# EAGLE schematic Felderblock6-a-1 (EAGLE 9.6.2)
AUTHOR: Balazs Racz; DRAWING_TITLE: Felderblock Mockup; LICENSE: Licensed by the Solderpad Hardware License V2.0; REVISION: A1; YEAR: 2024
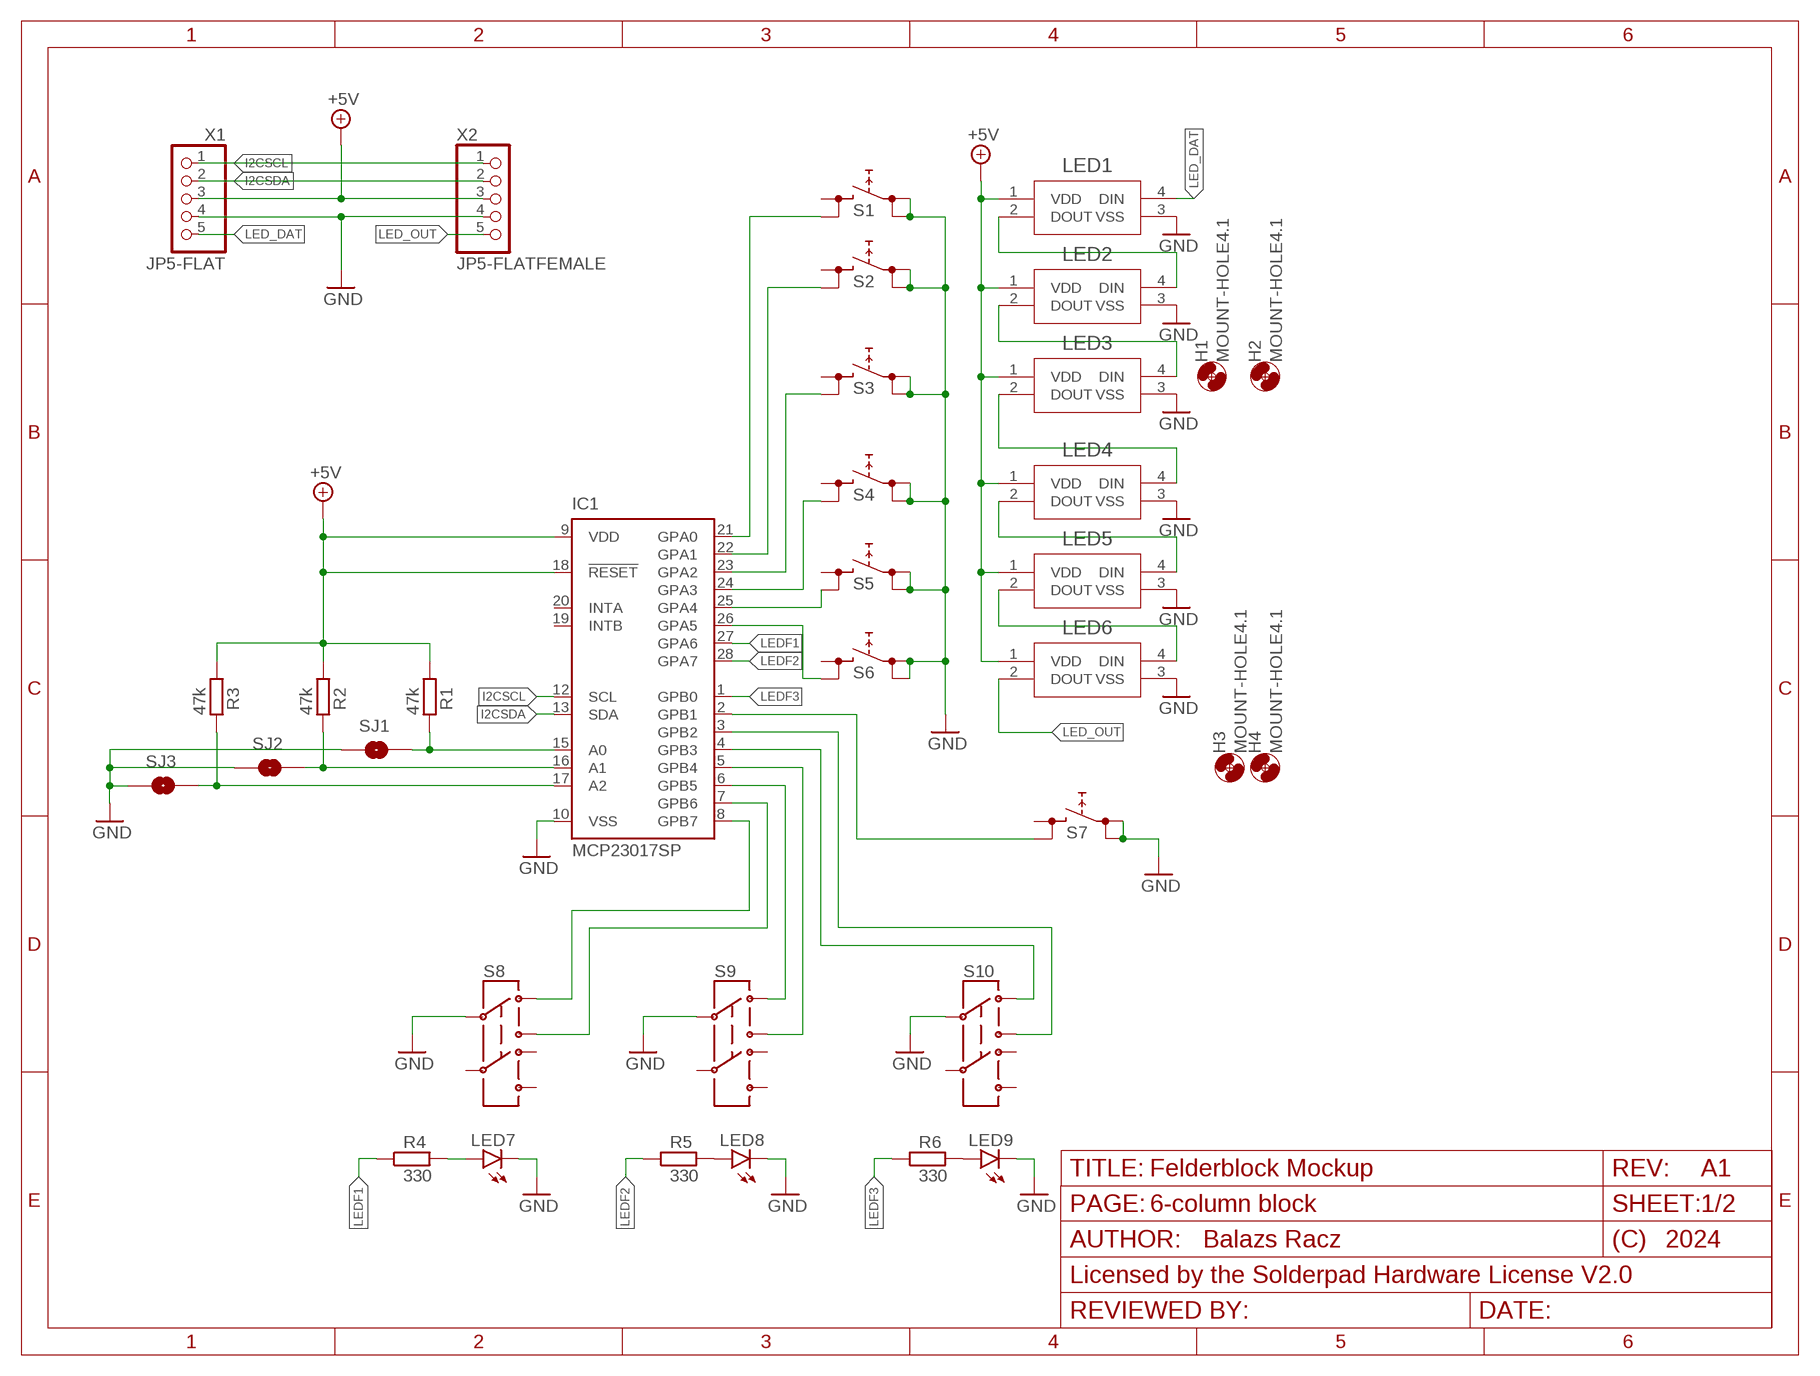
[diagram p0: schematic, sheet 1]
FRAME1 (FRAME_A_L): PAGE: 6-column block
FRAME2 (FRAME_A_L): PAGE: Input ports

## Parts
H1  MOUNT-HOLE4.1  [4,1]
H2  MOUNT-HOLE4.1  [4,1]
H3  MOUNT-HOLE4.1  [4,1]
H4  MOUNT-HOLE4.1  [4,1]
IC1  MCP23017SP  [DIL28-3]
LED1  LED-2812BCOM-16347_SPK-M  [COM-16347_SPK-M]
LED2  LED-2812BCOM-16347_SPK-M  [COM-16347_SPK-M]
LED3  LED-2812BCOM-16347_SPK-M  [COM-16347_SPK-M]
LED4  LED-2812BCOM-16347_SPK-M  [COM-16347_SPK-M]
LED5  LED-2812BCOM-16347_SPK-M  [COM-16347_SPK-M]
LED6  LED-2812BCOM-16347_SPK-M  [COM-16347_SPK-M]
LED7  LEDCHIPLED_0805  [CHIPLED_0805]
LED8  LEDCHIPLED_0805  [CHIPLED_0805]
LED9  LEDCHIPLED_0805  [CHIPLED_0805]
R1  47k  R-EU_R0805  [R0805]
R2  47k  R-EU_R0805  [R0805]
R3  47k  R-EU_R0805  [R0805]
R4  330  R-EU_R0805  [R0805]
R5  330  R-EU_R0805  [R0805]
R6  330  R-EU_R0805  [R0805]
S1  W1  TACTSW-6X6S  [TACTSW-6X6]
S2  W1  TACTSW-6X6S  [TACTSW-6X6]
S3  W1  TACTSW-6X6S  [TACTSW-6X6]
S4  W1  TACTSW-6X6S  [TACTSW-6X6]
S5  W1  TACTSW-6X6S  [TACTSW-6X6]
S6  W1  TACTSW-6X6S  [TACTSW-6X6]
S7  W1  TACTSW-6X6S  [TACTSW-6X6]
S8  SWITCH-DPDT  [DP-T1]
S9  SWITCH-DPDT  [DP-T1]
S10  SWITCH-DPDT  [DP-T1]
SJ1  SJRND2  [SJ_RND2]
SJ2  SJRND2  [SJ_RND2]
SJ3  SJRND2  [SJ_RND2]
X1  JP5-FLAT  [JP5F]
X2  JP5-FLATFEMALE  [JP5F-FEM]

## Nets
+5V: IC1.9(VDD) IC1.18(!RESET) LED1.1(VDD) LED2.1(VDD) LED3.1(VDD) LED4.1(VDD) LED5.1(VDD) LED6.1(VDD) R1.1 R2.1 R3.1 X1.3 X2.3
GND: IC1.10(VSS) LED1.3(VSS) LED2.3(VSS) LED3.3(VSS) LED4.3(VSS) LED5.3(VSS) LED6.3(VSS) LED7.C LED8.C LED9.C S1.1(1.1) S1.2(1.2) S2.1(1.1) S2.2(1.2) S3.1(1.1) S3.2(1.2) S4.1(1.1) S4.2(1.2) S5.1(1.1) S5.2(1.2) S6.1(1.1) S6.2(1.2) S7.1(1.1) S7.2(1.2) S8.2(1C) S9.2(1C) S10.2(1C) SJ1.P$1 SJ2.P$1 SJ3.P$1 X1.4 X2.4
I2CSCL: IC1.12(SCL) X1.1 X2.1
I2CSDA: IC1.13(SDA) X1.2 X2.2
LED_DAT: LED1.4(DIN) X1.5
LED_OUT: LED6.2(DOUT) X2.5
LEDF1: IC1.27(GPA6) R4.1
LEDF2: IC1.28(GPA7) R5.1
LEDF3: IC1.1(GPB0) R6.1
N$1: IC1.15(A0) R1.2 SJ1.P$2
N$2: IC1.16(A1) R2.2 SJ2.P$2
N$3: IC1.17(A2) R3.2 SJ3.P$2
N$4: IC1.21(GPA0) S1.4(2.2)
N$5: IC1.22(GPA1) S2.4(2.2)
N$6: IC1.23(GPA2) S3.4(2.2)
N$7: IC1.24(GPA3) S4.4(2.2)
N$8: IC1.25(GPA4) S5.4(2.2)
N$9: IC1.26(GPA5) S6.4(2.2)
N$10: IC1.8(GPB7) S8.1(1A)
N$11: IC1.7(GPB6) S8.3(1B)
N$12: LED1.2(DOUT) LED2.4(DIN)
N$13: LED2.2(DOUT) LED3.4(DIN)
N$14: LED3.2(DOUT) LED4.4(DIN)
N$15: LED4.2(DOUT) LED5.4(DIN)
N$16: LED5.2(DOUT) LED6.4(DIN)
N$17: IC1.6(GPB5) S9.1(1A)
N$18: IC1.5(GPB4) S9.3(1B)
N$19: IC1.4(GPB3) S10.1(1A)
N$20: IC1.3(GPB2) S10.3(1B)
N$21: LED8.A R5.2
N$22: LED7.A R4.2
N$23: LED9.A R6.2
N$24: IC1.2(GPB1) S7.4(2.2)
Unconnected: IC1.19(INTB) IC1.20(INTA) S1.3(2.1) S2.3(2.1) S3.3(2.1) S4.3(2.1) S5.3(2.1) S6.3(2.1) S7.3(2.1) S8.4(2A) S8.5(2C) S8.6(2B) S9.4(2A) S9.5(2C) S9.6(2B) S10.4(2A) S10.5(2C) S10.6(2B)

## Library data of the parts
H1-H4 = holes:MOUNT-HOLE: MOUNTING HOLE with drill center marker
IC1 = microchip:MCP23017: http://ww1.microchip.com/downloads/en/DeviceDoc/21952a.pdf Source: http://ww1.microchip.com/downloads/en/DeviceDoc/21952a.pdf; MF: MICROCHIP; MPN: MCP23017-E/SP; OC_FARNELL: 1332088; OC_NEWARK: 31K2959
LED1-LED6 = eagleparts:LED-2812B; COPYRIGHT: Copyright (C) 2024 Ultra Librarian. All rights reserved.; MANUFACTURER_PART_NUMBER: COM-16347; MFR_NAME: Sparkfun; TYPE: LED Addressable
LED7-LED9 = led:LED: LED OSRAM: - CHIPLED LG R971, LG N971, LY N971, LG Q971, LY Q971, LO R971, LY R971 LH N974, LH R974 LS Q976, LO Q976, LY Q976 LO Q996 - Hyper CHIPLED LW Q18S LB Q993, LB Q99A, LB R99A - SideLED LS A670, LO A670, LY A670, LG A670, LP A670 LB A673, LV A673, LT A673, LW A673 LH A674 LY A675 LS A676, LA A676, LO A676, LY A676, LW A676 LS A679, LY A679, LG A679 - Hyper Micro SIDELED® LS Y876, LA Y876, LO Y876, LY Y876 LT Y87S - SmartLED LW L88C, LW L88S LB L89C, LB L89S, LG L890 LS L89K, LO L89K, LY L89K LS L896, LA L896, LO L896, LY L896 - TOPLED LS T670, LO T670, LY T670, LG T670, LP T670 LSG T670, LSP T670, LSY T670, LOP T670, LYG T670 LG T671, LOG T671, LSG T671 LB T673, LV T673, LT T673, LW T673 LH T674 LS T676, LA T676, LO T676, LY T676, LB T676, LH T676, LSB T676, LW T676 LB T67C, LV T67C, LT T67C, LS T67K, LO T67K, LY T67K, LW E67C LS E67B, LA E67B, LO E67B, LY E67B, LB E67C, LV E67C, LT E67C LW T67C LS T679, LY T679, LG T679 LS T770, LO T770, LY T770, LG T770, LP T770 LB T773, LV T773, LT T773, LW T773 LH T774 LS E675, LA E675, LY E675, LS T675 LS T776, LA T776, LO T776, LY T776, LB T776 LHGB T686 LT T68C, LB T68C - Hyper Mini TOPLED® LB M676 - Mini TOPLED Santana® LG M470 LS M47K, LO M47K, LY M47K Source: http://www.osram.convergy.de LUXEON: - LUMILED® LXK2-PW12-R00, LXK2-PW12-S00, LXK2-PW14-U00, LXK2-PW14-V00 LXK2-PM12-R00, LXK2-PM12-S00, LXK2-PM14-U00 LXK2-PE12-Q00, LXK2-PE12-R00, LXK2-PE12-S00, LXK2-PE14-T00, LXK2-PE14-U00 LXK2-PB12-K00, LXK2-PB12-L00, LXK2-PB12-M00, LXK2-PB14-N00, LXK2-PB14-P00, LXK2-PB14-Q00 LXK2-PR12-L00, LXK2-PR12-M00, LXK2-PR14-Q00, LXK2-PR14-R00 LXK2-PD12-Q00, LXK2-PD12-R00, LXK2-PD12-S00 LXK2-PH12-R00, LXK2-PH12-S00 LXK2-PL12-P00, LXK2-PL12-Q00, LXK2-PL12-R00 Source: www.luxeon.com KINGBRIGHT: KA-3528ASYC Source: www.kingbright.com
R1-R6 = rcl:R-EU_: RESISTOR, European symbol; SPICEPREFIX: R
S1-S7 = g-e2e-training:TACTSW-6X6: 6.2 X 6.5mm TACT Switch (SMD) Source: http://www3.alps.co.jp/WebObjects/catalog.woa/PDF/E/Switch/Tact/SKHM/SKHM.PDF
S8-S10 = eagleparts:SWITCH-DPDT: DPDT Version of the COM-00597
SJ1-SJ3 = eagleparts:SJ: SMD solder JUMPER
X1 X2 = eagleparts:JP5-FLAT

## Net classes
0 default: width 0.254 mm, clearance 0.254 mm